# EasyEDA schematic 原理图源文件.json
TITLE: Sheet_1; REV: 1.0; Date: 2023-04-09; Sheet: 1/1; Drawn By: zarzi; Company: Your Company
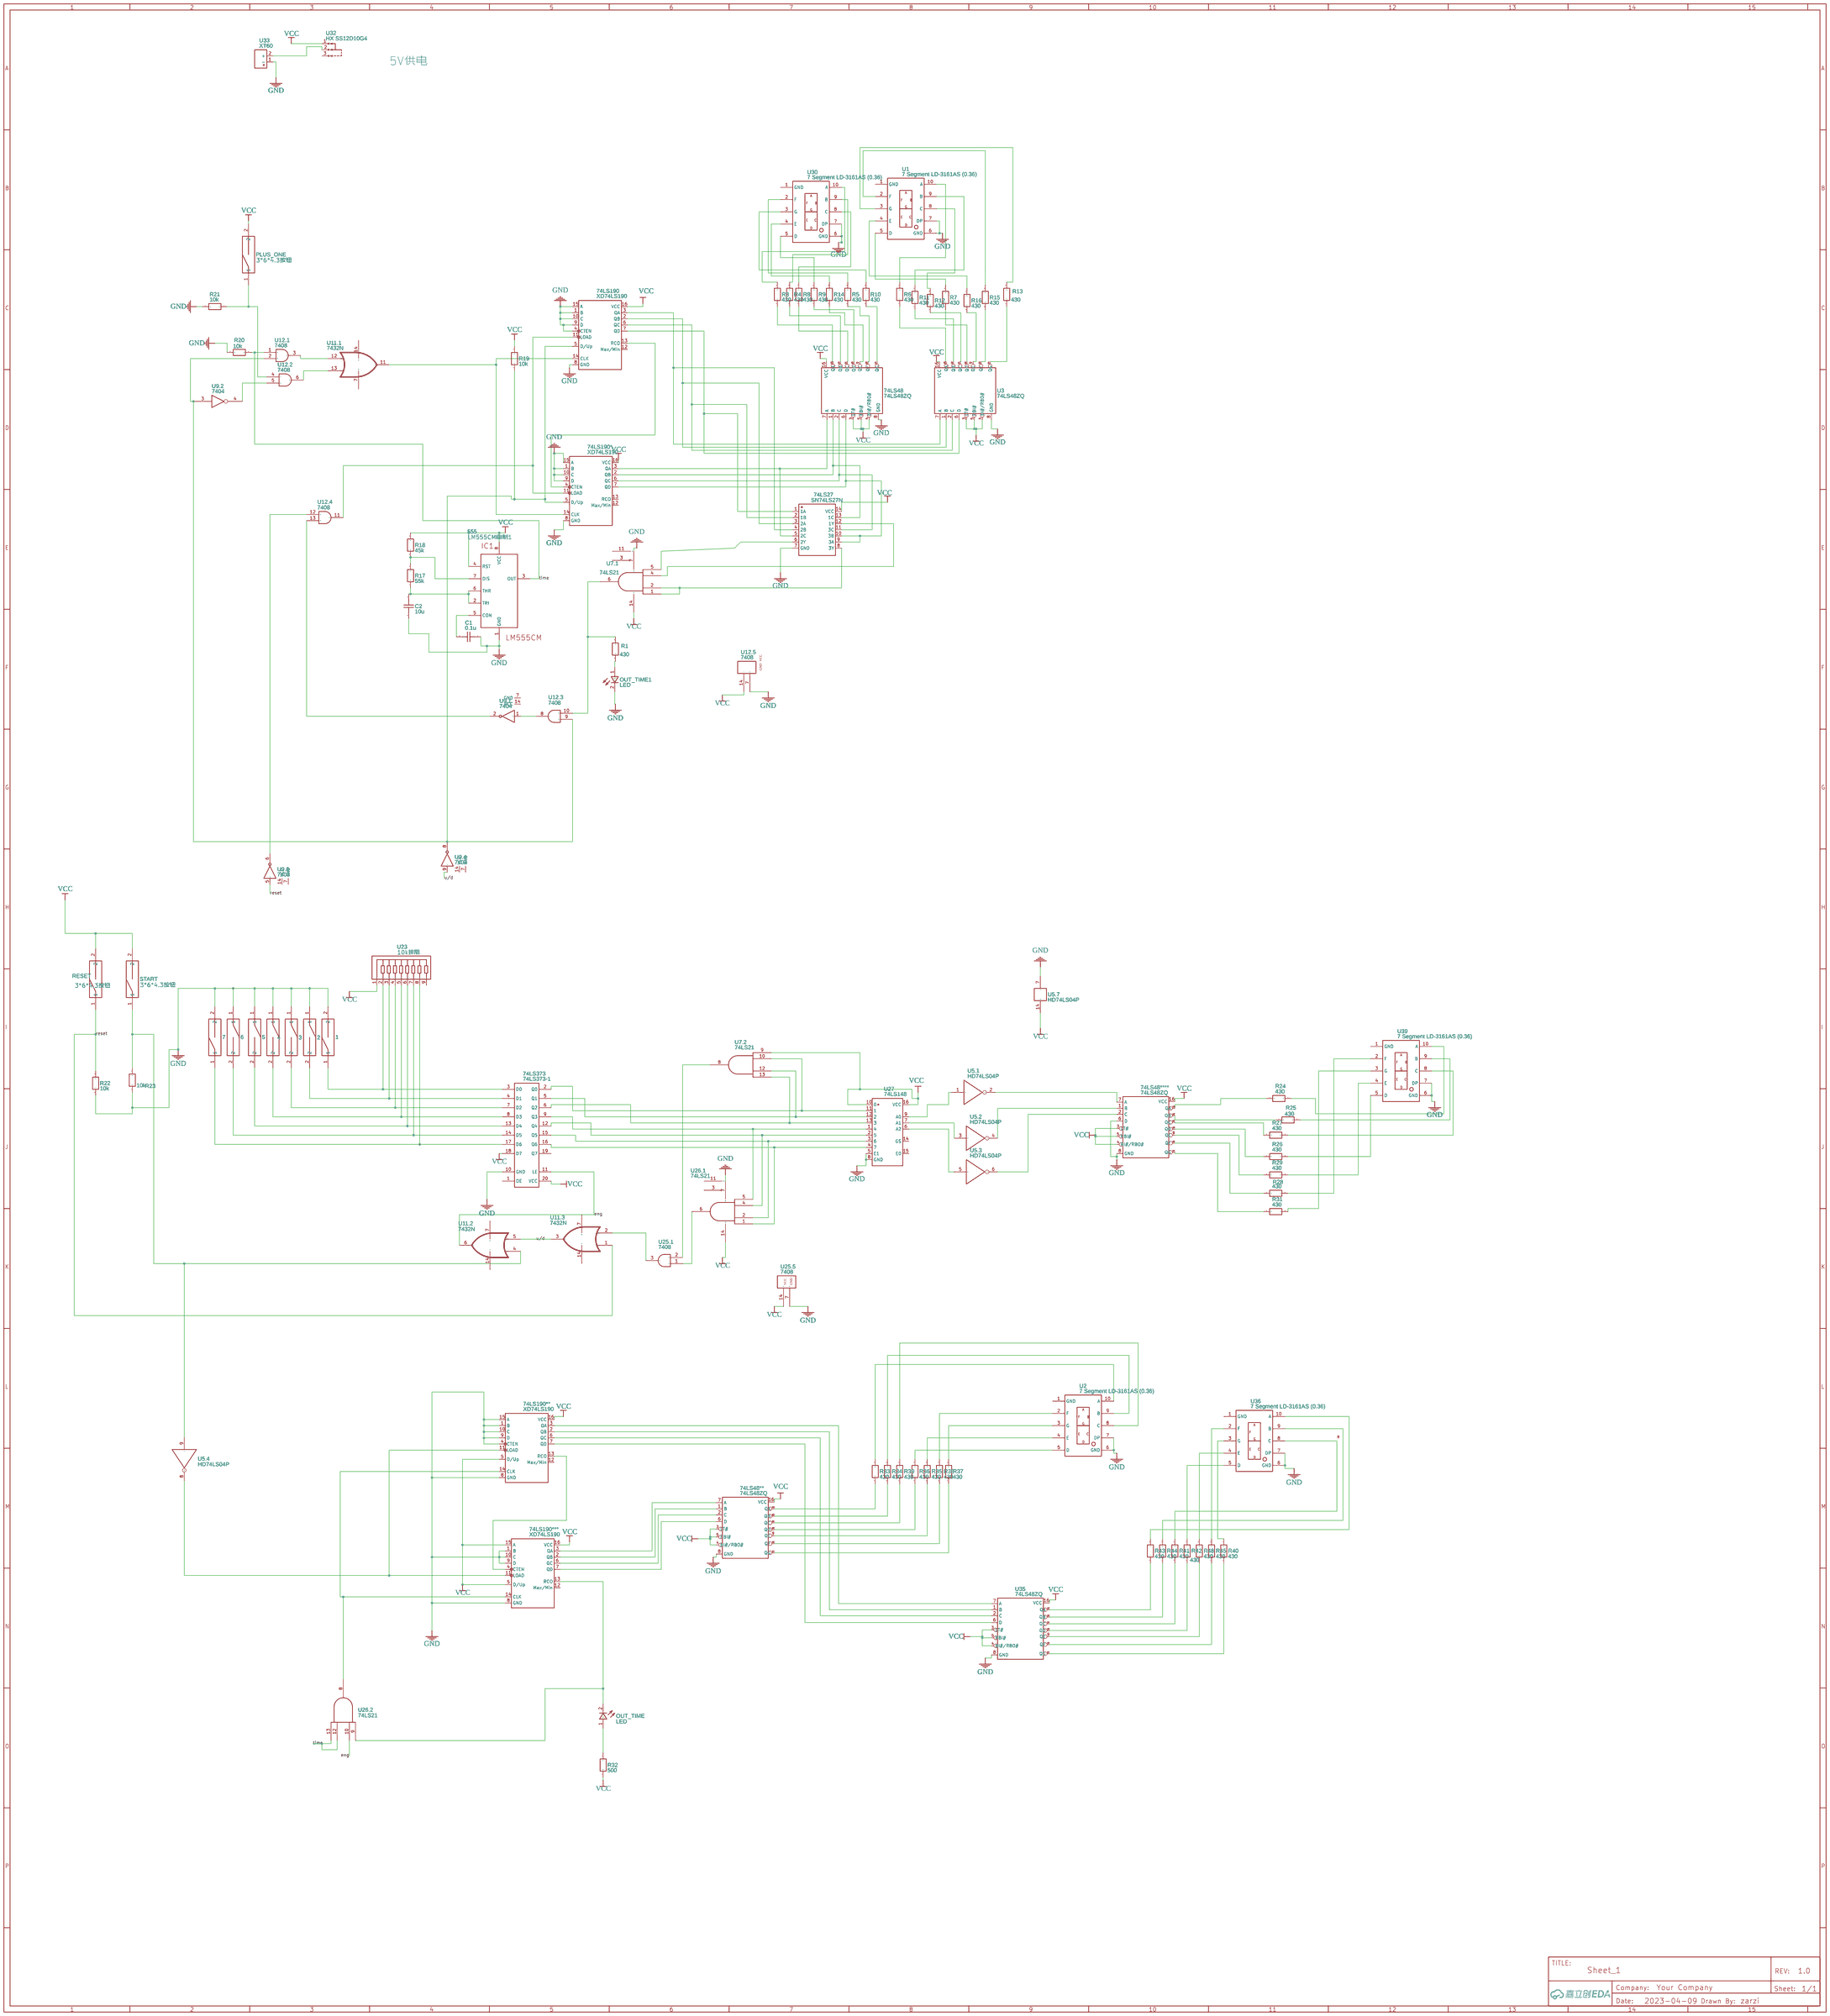
[diagram p0: schematic sheet]

## Parts
1  3*6*4.3按钮  [3*6*4.3按钮]
2  3*6*4.3按钮  [3*6*4.3按钮]
3  3*6*4.3按钮  [3*6*4.3按钮]
4  3*6*4.3按钮  [3*6*4.3按钮]
5  3*6*4.3按钮  [3*6*4.3按钮]
6  3*6*4.3按钮  [3*6*4.3按钮]
7  3*6*4.3按钮  [3*6*4.3按钮]
74LS27  SN74LS27N  [DIP14]
74LS48  74LS48ZQ  [74LS48]
74LS48**  74LS48ZQ  [74LS48]
74LS48****  74LS48ZQ  [74LS48]
74LS190  XD74LS190  [DIP-16_L20.0-W6.4-P2.54-LS7.6-BL]
74LS190*  XD74LS190  [DIP-16_L20.0-W6.4-P2.54-LS7.6-BL]
74LS190**  XD74LS190  [DIP-16_L20.0-W6.4-P2.54-LS7.6-BL]
74LS190***  XD74LS190  [DIP-16_L20.0-W6.4-P2.54-LS7.6-BL]
74LS373  74LS373-1  [74LS373]
555  LM555CM自制1  [LM555CM封装]
C1  0.1u  [C0603]
C2  10u  [C0603]
OUT_TIME  LED  [LED-TH_LED-DP2-1LED]
OUT_TIME1  LED  [LED-TH_LED-DP2-1LED]
PLUS_ONE  3*6*4.3按钮  [3*6*4.3按钮]
R1  430  [R0603]
R3  430  [R0805]
R4  430  [R0805]
R5  430  [R0805]
R6  430  [R0805]
R7  430  [R0805]
R8  430  [R0805]
R9  430  [R0805]
R10  430  [R0805]
R11  430  [R0805]
R12  430  [R0805]
R13  430  [R0805]
R14  430  [R0805]
R15  430  [R0805]
R16  430  [R0805]
R17  55k  [R0603]
R18  45k  [R0603]
R19  10k  [R0805]
R20  10k  [R0805]
R21  10k  [R0805]
R22  10k  [R0805]
R23  10k  [R0805]
R24  430  [R0805]
R25  430  [R0805]
R26  430  [R0805]
R27  430  [R0805]
R28  430  [R0805]
R29  430  [R0805]
R31  430  [R0805]
R32  500  [R0603]
R33  430  [R0805]
R34  430  [R0805]
R35  430  [R0805]
R36  430  [R0805]
R37  430  [R0805]
R38  430  [R0805]
R39  430  [R0805]
R40  430  [R0805]
R41  430  [R0805]
R42  430  [R0805]
R43  430  [R0805]
R44  430  [R0805]
R45  430  [R0805]
R48  430  [R0805]
RESET  3*6*4.3按钮  [3*6*4.3按钮]
START  3*6*4.3按钮  [3*6*4.3按钮]
U1  7 Segment LD-3161AS (0.36)  [7 SEGMENT LD-3161AS (0.36) КОРПУС]
U2  7 Segment LD-3161AS (0.36)  [7 SEGMENT LD-3161AS (0.36) КОРПУС]
U3  74LS48ZQ  [74LS48]
U5  HD74LS04P  [DIP-14_L19.4-W6.4-P2.54-LS7.6-BL]  (sections 1,2,3,4,7)
U7  74LS21  [DIP-14]  (sections 1,2)
U9  7404  [DIP14]  (sections 1,2,3,4)
U11  7432N  [DIL14]  (sections 1,2,3)
U12  7408  [DIP14]  (sections 1,2,3,4,5)
U23  10k排阻  [SIP-9]
U25  7408  [DIP14]  (sections 1,5)
U26  74LS21  [DIP-14]  (sections 1,2)
U27  74LS148  [DIP-16_L19.2-W6.6-P2.54-LS7.6-BL]
U30  7 Segment LD-3161AS (0.36)  [7 SEGMENT LD-3161AS (0.36) КОРПУС]
U32  HX SS12D10G4  [SW-TH_SHOU-HAN_SS12D10G4]
U33  XT60  [CONN-TH_XT60]
U35  74LS48ZQ  [74LS48]
U36  7 Segment LD-3161AS (0.36)  [7 SEGMENT LD-3161AS (0.36) КОРПУС]
U39  7 Segment LD-3161AS (0.36)  [7 SEGMENT LD-3161AS (0.36) КОРПУС]

## Library data of the parts
1-7 PLUS_ONE RESET START = 3*6*4.3按钮: Contributor: chb_17
74LS27 = SN74LS27N
74LS48 74LS48** 74LS48**** U3 U35 = 74LS48ZQ: Supplier: LCSC; Supplier Part: C609759; Manufacturer: XINLUDA; Manufacturer Part: XD74LS48; Contributor: 杨佳敏
74LS190 74LS190* 74LS190** 74LS190*** = XD74LS190: Supplier: LCSC; Supplier Part: C707104; Manufacturer: XINLUDA; Contributor: mamo
74LS373 = 74LS373-1: Contributor: ayong82
555 = LM555CM自制1: Contributor: xiaosuntongxue
C1 C2 = C_0603_US: Contributor: LCEDA_Lib
OUT_TIME OUT_TIME1 = LED 直插 COPY: Supplier: LCSC; JLCPCB Part Class: Extended Part; Contributor: angian
R1 R3-R16 R24-R29 R31 R33-R45 R48 = R_0805_EU: Contributor: LCEDA_Lib
R17-R23 R32 = R_0603_EU: Contributor: LCEDA_Lib
U1 U2 U30 U36 U39 = 7 Segment LD-3161AS (0.36): link: https://www.google.ru/url?sa=t&rct=j&q=&esrc=s&source=web&cd=1&ved=0ahUKEwi5hsjw2vfWAhXMHJoKHQGPCgEQFggtMAA&url=https%3A%2F%2Fe-radionica.com%2Fproductdata%2FLD3361BS.pdf&usg=AOvVaw2qYu_p2O1tV3GKS_G8gpl1; Contributor: ufobobrovsk
U5 = HD74LS04P: Supplier: LCSC; Supplier Part: C5257; Manufacturer: RENESAS(瑞萨)/IDT; Contributor: MDDD; JLCPCB Part Class: Extended Part; subpart_no: 1
U7 U26 = 74LS21: Contributor: 电气17; subpart_no: 1
U9 = 7404: sourceId: 1hpjBvM4Y; subpart_no: 1
U11 = 7432N: Quad 2-input OR gate; subpart_no: 1
U12 U25 = 7408: Contributor: NobMaster; subpart_no: 1
U23 = 排阻: Contributor: e_e_e
U27 = 74LS148: Supplier: LCSC; Supplier Part: C521197; Manufacturer: XINLUDA; Manufacturer Part: XD74LS148; Contributor: ml265915; JLCPCB Part Class: Extended Part
U32 = HX SS12D10G4: Supplier: LCSC; Supplier Part: C5149841; Manufacturer: hanxia(韩下); link: https://atta.szlcsc.com/upload/public/pdf/source/20220907/2020D7183ED16DD6E2B9F5A13FB144CF.pdf; Contributor: lcsc; JLCPCB Part Class: Extended Part
U33 = XT60: Supplier: LCSC; Supplier Part: C98733; Manufacturer: AMASS(艾迈斯); link: https://atta.szlcsc.com/upload/public/pdf/source/20170606/1496716524919.pdf; JLCPCB Part Class: Extended Part; Contributor: lcsc

## Nets
GND: 1.2 2.1 3.1 4.1 5.1 6.1 7.2 74LS27.7(GND) 74LS48.8(GND) 74LS48**.8(GND) 74LS48****.6(D) 74LS48****.8(GND) 74LS190.1(B) 74LS190.4(CTEN) 74LS190.8(GND) 74LS190.9(D) 74LS190.10(C) 74LS190.15(A) 74LS190*.1(B) 74LS190*.8(GND) 74LS190*.9(D) 74LS190*.10(C) 74LS190*.15(A) 74LS190**.1(B) 74LS190**.4(CTEN) 74LS190**.8(GND) 74LS190**.9(D) 74LS190**.10(C) 74LS190**.15(A) 74LS190***.1(B) 74LS190***.8(GND) 74LS190***.9(D) 74LS190***.10(C) 74LS373.10(GND) 555.1(GND) C1.1 C2.1 OUT_TIME1.2(K1) R20.1 R21.1 R22.2 R23.2 U1.6(GND) U1.7(DP) U2.6(GND) U2.7(DP) U3.8(GND) U5.7(1) U7.7(GND) U12.7(G) U25.7(G) U26.7(GND) U27.5(E1) U27.8(GND) U30.6(GND) U30.7(DP) U33.1(-) U35.8(GND) U36.6(GND) U36.7(DP) U39.6(GND) U39.7(DP)
VCC: 74LS27.14(VCC) 74LS48.3(LT#) 74LS48.4(BI#/RBO#) 74LS48.5(RBI#) 74LS48.16(VCC) 74LS48**.3(LT#) 74LS48**.4(BI#/RBO#) 74LS48**.5(RBI#) 74LS48**.16(VCC) 74LS48****.3(LT#) 74LS48****.4(BI#/RBO#) 74LS48****.5(RBI#) 74LS48****.16(VCC) 74LS190.16(VCC) 74LS190*.16(VCC) 74LS190**.5(D/Up) 74LS190**.16(VCC) 74LS190***.5(D/Up) 74LS190***.15(A) 74LS190***.16(VCC) 74LS373.18(D7) 74LS373.20(VCC) 555.4(RST) 555.8(VCC) PLUS_ONE.2 R18.2 R19.2 R32.2 RESET.2 START.2 U3.3(LT#) U3.4(BI#/RBO#) U3.5(RBI#) U3.16(VCC) U5.14(2) U7.9 U7.14(VCC) U12.14(E) U23.1 U25.14(E) U26.14(VCC) U27.10(0) U27.16(VCC) U32.1 U35.3(LT#) U35.4(BI#/RBO#) U35.5(RBI#) U35.16(VCC)
eng: 74LS373.11(LE) U11.6(O) U26.10
reset: R22.1 RESET.1 U9.5(3A) U11.1(I0)
time: 555.3(OUT) R20.2 U12.1 U26.12 U26.13
u/d: U9.9(4A) U11.3(O) U11.5(I1)
Net-(1-1): 1.1 74LS373.3(D0) U23.2
Net-(2-2): 2.2 74LS373.4(D1) U23.3
Net-(3-2): 3.2 74LS373.7(D2) U23.4
Net-(4-2): 4.2 74LS373.8(D3) U23.5
Net-(5-2): 5.2 74LS373.13(D4) U23.6
Net-(6-2): 6.2 74LS373.14(D5) U23.7
Net-(7-1): 7.1 74LS373.17(D6) U23.8
Net-(74LS27-1): 74LS27.1(1A) 74LS190.7(QD) U3.6(D)
Net-(74LS27-2): 74LS27.2(1B) 74LS190.6(QC) U3.2(C)
Net-(74LS27-3): 74LS27.3(2A) 74LS190.2(QB) U3.1(B)
Net-(74LS27-4): 74LS27.4(2B) 74LS190.3(QA) U3.7(A)
Net-(74LS27-5): 74LS27.5(2C) 74LS48.7(A) 74LS190*.3(QA)
Net-(74LS27-6): 74LS27.6(2Y) U7.5
Net-(74LS27-8): 74LS27.8(3Y) U7.1 U7.2
Net-(74LS27-9): 74LS27.9(3A) 74LS27.10(3B) 74LS48.6(D) 74LS190*.7(QD)
Net-(74LS27-11): 74LS27.11(3C) 74LS48.2(C) 74LS190*.6(QC)
Net-(74LS27-12): 74LS27.12(1Y) U7.4
Net-(74LS27-13): 74LS27.13(1C) 74LS48.1(B) 74LS190*.2(QB)
Net-(74LS48****-1): 74LS48****.1(B) U5.4(2)
Net-(74LS48****-2): 74LS48****.2(C) U5.6(2)
Net-(74LS48****-7): 74LS48****.7(A) U5.2
Net-(74LS48****-9): 74LS48****.9(QE) R29.1
Net-(74LS48****-10): 74LS48****.10(QD) R26.1
Net-(74LS48****-11): 74LS48****.11(QC) R27.1
Net-(74LS48****-12): 74LS48****.12(QB) R25.1
Net-(74LS48****-13): 74LS48****.13(QA) R24.1
Net-(74LS48****-14): 74LS48****.14(QG) R31.1
Net-(74LS48****-15): 74LS48****.15(QF) R28.1
Net-(74LS48**-1): 74LS48**.1(B) 74LS190***.2(QB)
Net-(74LS48**-2): 74LS48**.2(C) 74LS190***.6(QC)
Net-(74LS48**-6): 74LS48**.6(D) 74LS190***.7(QD)
Net-(74LS48**-7): 74LS48**.7(A) 74LS190***.3(QA)
Net-(74LS48**-9): 74LS48**.9(QE) R35.1
Net-(74LS48**-10): 74LS48**.10(QD) R36.1
Net-(74LS48**-11): 74LS48**.11(QC) R39.1
Net-(74LS48**-12): 74LS48**.12(QB) R34.1
Net-(74LS48**-13): 74LS48**.13(QA) R33.1
Net-(74LS48**-14): 74LS48**.14(QG) R37.1
Net-(74LS48**-15): 74LS48**.15(QF) R38.1
Net-(74LS48-9): 74LS48.9(QE) R14.1
Net-(74LS48-10): 74LS48.10(QD) R9.1
Net-(74LS48-11): 74LS48.11(QC) R8.1
Net-(74LS48-12): 74LS48.12(QB) R4.1
Net-(74LS48-13): 74LS48.13(QA) R3.1
Net-(74LS48-14): 74LS48.14(QG) R10.1
Net-(74LS48-15): 74LS48.15(QF) R5.1
Net-(74LS190***-13): 74LS190***.13(RCO) OUT_TIME.2(K1) U26.9
Net-(74LS190**-2): 74LS190**.2(QB) U35.1(B)
Net-(74LS190**-3): 74LS190**.3(QA) U35.7(A)
Net-(74LS190**-6): 74LS190**.6(QC) U35.2(C)
Net-(74LS190**-7): 74LS190**.7(QD) U35.6(D)
Net-(74LS190**-11): 74LS190**.11(LOAD) 74LS190***.11(LOAD) U5.8(2)
Net-(74LS190**-13): 74LS190**.13(RCO) 74LS190***.4(CTEN)
Net-(74LS190**-14): 74LS190**.14(CLK) 74LS190***.14(CLK) U26.8
Net-(74LS190-5): 74LS190.5(D/Up) 74LS190*.5(D/Up) R19.1 U9.3 U9.8(4Y) U12.2 U12.9
Net-(74LS190-11): 74LS190.11(LOAD) 74LS190*.11(LOAD) U12.11
Net-(74LS190-13): 74LS190.13(RCO) 74LS190*.4(CTEN)
Net-(74LS190-14): 74LS190.14(CLK) 74LS190*.14(CLK) U11.11(O)
Net-(74LS373-2): 74LS373.2(Q0) U7.10 U27.11(1)
Net-(74LS373-5): 74LS373.5(Q1) U7.12 U27.12(2)
Net-(74LS373-6): 74LS373.6(Q2) U7.13 U27.13(3)
Net-(74LS373-9): 74LS373.9(Q3) U26.5 U27.1(4)
Net-(74LS373-12): 74LS373.12(Q4) U26.4 U27.2(5)
Net-(74LS373-15): 74LS373.15(Q5) U26.2 U27.3(6)
Net-(74LS373-16): 74LS373.16(Q6) U26.1 U27.4(7)
Net-(555-2): 555.2(TRI) 555.6(THR) C2.2 R17.1
Net-(555-5): 555.5(CON) C1.2
Net-(555-7): 555.7(DIS) R17.2 R18.1
Net-(OUT_TIME1-1): OUT_TIME1.1(A1) R1.1
Net-(OUT_TIME-1): OUT_TIME.1(A1) R32.1
Net-(PLUS_ONE-1): PLUS_ONE.1 R21.2 U12.4
Net-(R1-2): R1.2 U7.6 U12.10
Net-(R3-2): R3.2 U30.10(A)
Net-(R4-2): R4.2 U30.9(B)
Net-(R5-2): R5.2 U30.2(F)
Net-(R6-1): R6.1 U3.13(QA)
Net-(R6-2): R6.2 U1.10(A)
Net-(R7-1): R7.1 U3.10(QD)
Net-(R7-2): R7.2 U1.5(D)
Net-(R8-2): R8.2 U30.8(C)
Net-(R9-2): R9.2 U30.5(D)
Net-(R10-2): R10.2 U30.3(G)
Net-(R11-1): R11.1 U3.12(QB)
Net-(R11-2): R11.2 U1.9(B)
Net-(R12-1): R12.1 U3.11(QC)
Net-(R12-2): R12.2 U1.8(C)
Net-(R13-1): R13.1 U3.14(QG)
Net-(R13-2): R13.2 U1.3(G)
Net-(R14-2): R14.2 U30.4(E)
Net-(R15-1): R15.1 U3.15(QF)
Net-(R15-2): R15.2 U1.2(F)
Net-(R16-1): R16.1 U3.9(QE)
Net-(R16-2): R16.2 U1.4(E)
Net-(R23-1): R23.1 START.1 U5.9(1) U11.4(I0)
Net-(R24-2): R24.2 U39.10(A)
Net-(R25-2): R25.2 U39.9(B)
Net-(R26-2): R26.2 U39.5(D)
Net-(R27-2): R27.2 U39.8(C)
Net-(R28-2): R28.2 U39.2(F)
Net-(R29-2): R29.2 U39.4(E)
Net-(R31-2): R31.2 U39.3(G)
Net-(R33-2): R33.2 U2.10(A)
Net-(R34-2): R34.2 U2.9(B)
Net-(R35-2): R35.2 U2.4(E)
Net-(R36-2): R36.2 U2.5(D)
Net-(R37-2): R37.2 U2.3(G)
Net-(R38-2): R38.2 U2.2(F)
Net-(R39-2): R39.2 U2.8(C)
Net-(R40-1): R40.1 U35.14(QG)
Net-(R40-2): R40.2 U36.3(G)
Net-(R41-1): R41.1 U35.11(QC)
Net-(R41-2): R41.2 U36.8(C)
Net-(R42-1): R42.1 U35.10(QD)
Net-(R42-2): R42.2 U36.5(D)
Net-(R43-1): R43.1 U35.13(QA)
Net-(R43-2): R43.2 U36.10(A)
Net-(R44-1): R44.1 U35.12(QB)
Net-(R44-2): R44.2 U36.9(B)
Net-(R45-1): R45.1 U35.15(QF)
Net-(R45-2): R45.2 U36.2(F)
Net-(R48-1): R48.1 U35.9(QE)
Net-(R48-2): R48.2 U36.4(E)
Net-(U5.1-1): U5.1 U27.9(A0)
Net-(U5.2-3): U5.3(1) U27.7(A1)
Net-(U5.3-5): U5.5(1) U27.6(A2)
Net-(U7.2-8): U7.8 U25.2
Net-(U9.1-1): U9.1(1A) U12.8
Net-(U9.1-2): U9.2(1Y) U12.13
Net-(U9.2-4): U9.4 U12.5
Net-(U9.3-6): U9.6(3Y) U12.12
Net-(U11.1-12): U11.12(I0) U12.3
Net-(U11.1-13): U11.13(I1) U12.6
Net-(U11.3-2): U11.2(I1) U25.3
Net-(U25.1-1): U25.1 U26.6
Net-(U32-2): U32.2 U33.2(+)

Not connected (* = marked no-connect by the designer): 74LS190 12(Max/Min); 74LS190* 12(Max/Min) 13(RCO); 74LS190** 12(Max/Min); 74LS190*** 12(Max/Min); 74LS373 1(OE) 19(Q7); U1 1(GND); U2 1(GND); U7 3(NC3) 11(NC11); U9 7(GND) 14(VCC); U11 7(GND) 14(VCC); U23 9; U26 3(NC3) 11(NC11); U27 14(GS) 15(E0); U30 1(GND); U32 3; U36 1(GND); U39 1(GND)

## Notes on the sheet
- 5V供电
